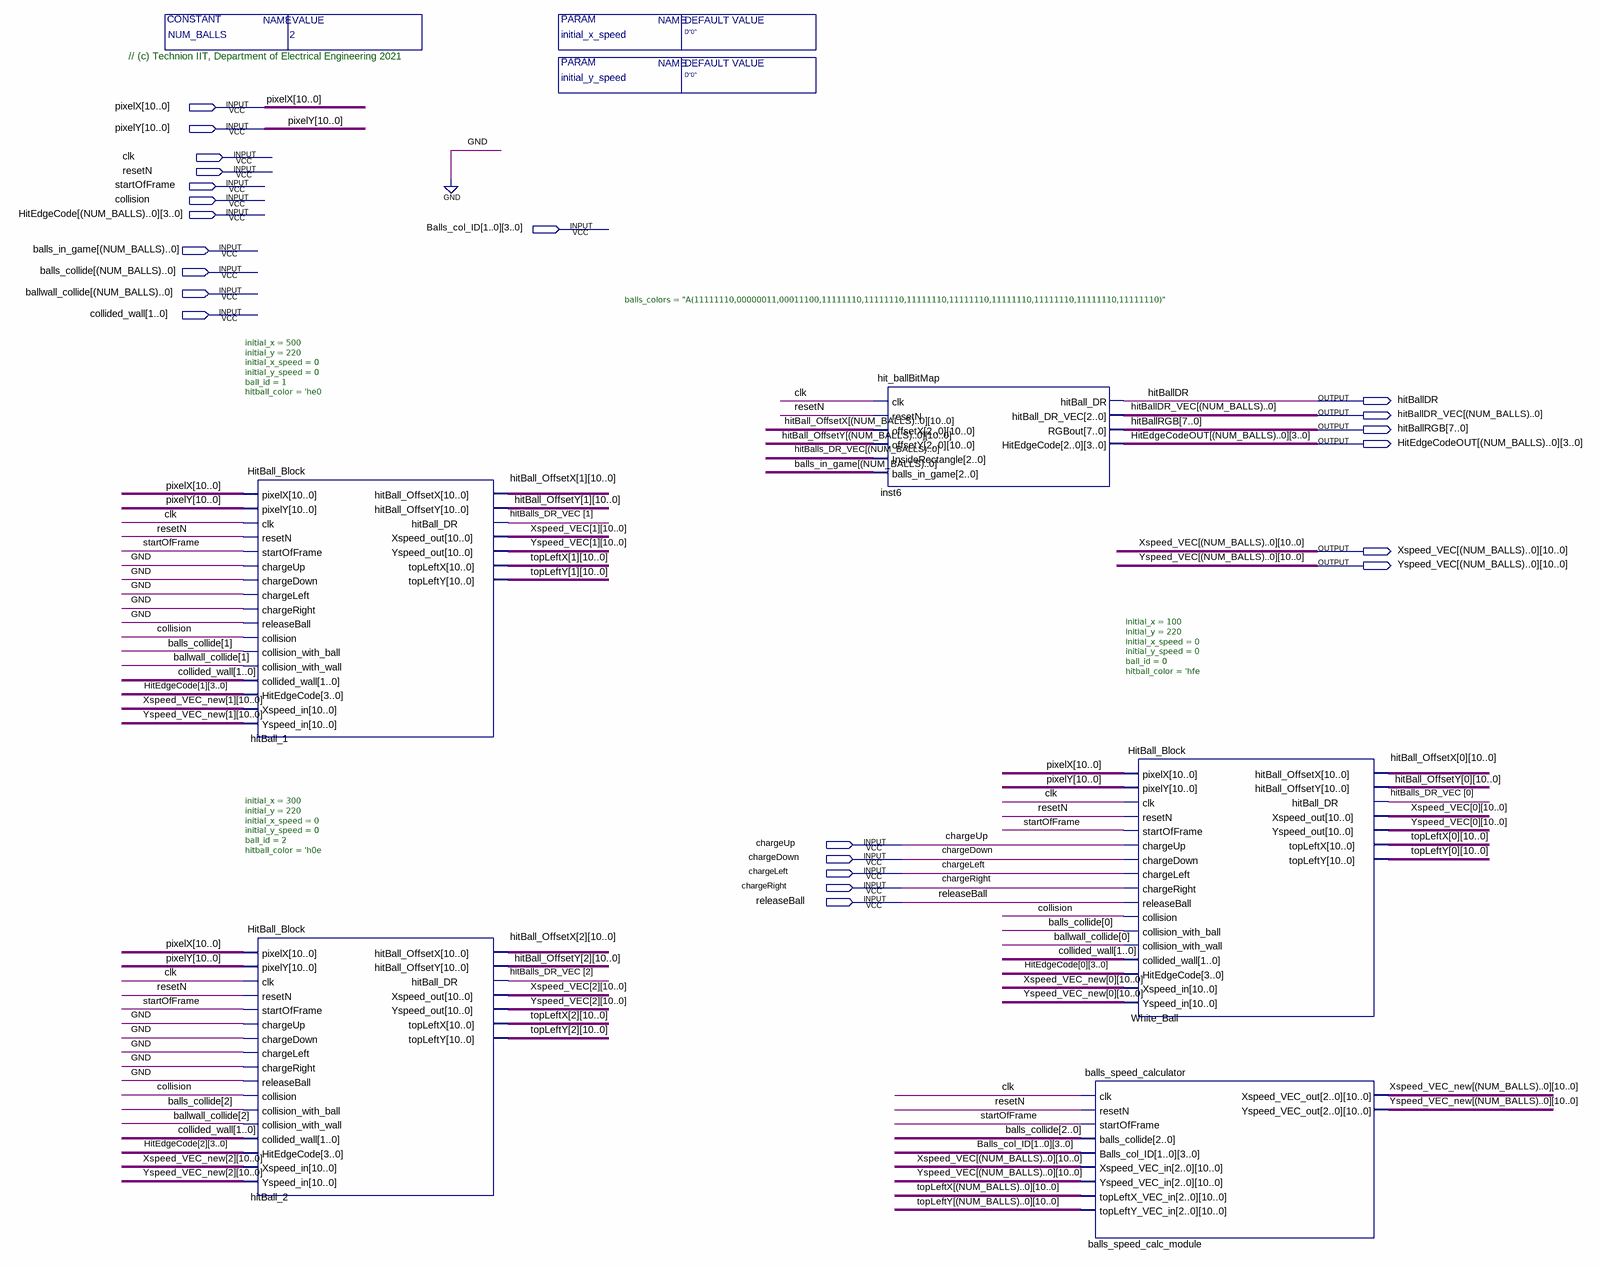
[diagram p0: schematic sheet]
// Quartus schematic United_HitBalls_Block.bdf as structural Verilog: 5 symbols, 23 pins
module United_HitBalls_Block #(parameter initial_x_speed = "D\"0\"", parameter initial_y_speed = "D\"0\"", parameter NUM_BALLS = 2) (
  input  [10:0] pixelX,
  input  [10:0] pixelY,
  input  clk,
  input  resetN,
  input  startOfFrame,
  input  collision,
  input  [3:0] HitEdgeCode_2,
  input  [3:0] HitEdgeCode_1,
  input  [3:0] HitEdgeCode_0,
  input  [3:0] Balls_col_ID_1,
  input  [3:0] Balls_col_ID_0,
  input  [2:0] balls_in_game,
  input  [2:0] balls_collide,
  input  [2:0] ballwall_collide,
  input  [1:0] collided_wall,
  input  chargeUp,
  input  chargeDown,
  input  chargeLeft,
  input  chargeRight,
  input  releaseBall,
  output hitBallDR,
  output [2:0] hitBallDR_VEC,
  output [7:0] hitBallRGB,
  output [3:0] HitEdgeCodeOUT_2,
  output [3:0] HitEdgeCodeOUT_1,
  output [3:0] HitEdgeCodeOUT_0,
  output [10:0] Xspeed_VEC_2,
  output [10:0] Xspeed_VEC_1,
  output [10:0] Xspeed_VEC_0,
  output [10:0] Yspeed_VEC_2,
  output [10:0] Yspeed_VEC_1,
  output [10:0] Yspeed_VEC_0
);

  wire [2:0] hitBalls_DR_VEC;
  wire [10:0] hitBall_OffsetX_0, hitBall_OffsetX_1, hitBall_OffsetX_2, hitBall_OffsetY_0, hitBall_OffsetY_1,
       hitBall_OffsetY_2, topLeftX_0, topLeftX_1, topLeftX_2, topLeftY_0, topLeftY_1, topLeftY_2,
       Xspeed_VEC_new_0, Xspeed_VEC_new_1, Xspeed_VEC_new_2, Yspeed_VEC_new_0, Yspeed_VEC_new_1,
       Yspeed_VEC_new_2;

  HitBall_Block #(.initial_x(500), .initial_y(220), .initial_x_speed(0), .initial_y_speed(0), .ball_id(1), .hitball_color('he0)) hitBall_1 (
    .pixelX(pixelX), .pixelY(pixelY), .clk(clk), .resetN(resetN), .startOfFrame(startOfFrame),
    .chargeUp(1'b0), .chargeDown(1'b0), .chargeLeft(1'b0), .chargeRight(1'b0), .releaseBall(1'b0),
    .collision(collision), .collision_with_ball(balls_collide[1]), .collision_with_wall(ballwall_collide[1]),
    .collided_wall(collided_wall), .HitEdgeCode(HitEdgeCode_1), .Xspeed_in(Xspeed_VEC_new_1),
    .Yspeed_in(Yspeed_VEC_new_1), .hitBall_OffsetX(hitBall_OffsetX_1), .hitBall_OffsetY(hitBall_OffsetY_1),
    .hitBall_DR(hitBalls_DR_VEC[1]), .Xspeed_out(Xspeed_VEC_1), .Yspeed_out(Yspeed_VEC_1),
    .topLeftX(topLeftX_1), .topLeftY(topLeftY_1));
  HitBall_Block #(.initial_x(300), .initial_y(220), .initial_x_speed(0), .initial_y_speed(0), .ball_id(2), .hitball_color('h0e)) hitBall_2 (
    .pixelX(pixelX), .pixelY(pixelY), .clk(clk), .resetN(resetN), .startOfFrame(startOfFrame),
    .chargeUp(1'b0), .chargeDown(1'b0), .chargeLeft(1'b0), .chargeRight(1'b0), .releaseBall(1'b0),
    .collision(collision), .collision_with_ball(balls_collide[2]), .collision_with_wall(ballwall_collide[2]),
    .collided_wall(collided_wall), .HitEdgeCode(HitEdgeCode_2), .Xspeed_in(Xspeed_VEC_new_2),
    .Yspeed_in(Yspeed_VEC_new_2), .hitBall_OffsetX(hitBall_OffsetX_2), .hitBall_OffsetY(hitBall_OffsetY_2),
    .hitBall_DR(hitBalls_DR_VEC[2]), .Xspeed_out(Xspeed_VEC_2), .Yspeed_out(Yspeed_VEC_2),
    .topLeftX(topLeftX_2), .topLeftY(topLeftY_2));
  hit_ballBitMap #(.balls_colors("A(11111110,00000011,00011100,11111110,11111110,11111110,11111110,11111110,11111110,11111110,11111110)")) inst6 (
    .clk(clk), .resetN(resetN), .offsetX({hitBall_OffsetX_2, hitBall_OffsetX_1, hitBall_OffsetX_0}),
    .offsetY({hitBall_OffsetY_2, hitBall_OffsetY_1, hitBall_OffsetY_0}), .InsideRectangle(hitBalls_DR_VEC),
    .balls_in_game(balls_in_game), .hitBall_DR(hitBallDR), .hitBall_DR_VEC(hitBallDR_VEC),
    .RGBout(hitBallRGB), .HitEdgeCode({HitEdgeCodeOUT_2, HitEdgeCodeOUT_1, HitEdgeCodeOUT_0}));
  balls_speed_calculator balls_speed_calc_module (
    .clk(clk), .resetN(resetN), .startOfFrame(startOfFrame), .balls_collide(balls_collide),
    .Balls_col_ID({Balls_col_ID_1, Balls_col_ID_0}),
    .Xspeed_VEC_in({Xspeed_VEC_2, Xspeed_VEC_1, Xspeed_VEC_0}),
    .Yspeed_VEC_in({Yspeed_VEC_2, Yspeed_VEC_1, Yspeed_VEC_0}),
    .topLeftX_VEC_in({topLeftX_2, topLeftX_1, topLeftX_0}),
    .topLeftY_VEC_in({topLeftY_2, topLeftY_1, topLeftY_0}),
    .Xspeed_VEC_out({Xspeed_VEC_new_2, Xspeed_VEC_new_1, Xspeed_VEC_new_0}),
    .Yspeed_VEC_out({Yspeed_VEC_new_2, Yspeed_VEC_new_1, Yspeed_VEC_new_0}));
  HitBall_Block #(.initial_x(100), .initial_y(220), .initial_x_speed(0), .initial_y_speed(0), .ball_id(0), .hitball_color('hfe)) White_Ball (
    .pixelX(pixelX), .pixelY(pixelY), .clk(clk), .resetN(resetN), .startOfFrame(startOfFrame),
    .chargeUp(chargeUp), .chargeDown(chargeDown), .chargeLeft(chargeLeft), .chargeRight(chargeRight),
    .releaseBall(releaseBall), .collision(collision), .collision_with_ball(balls_collide[0]),
    .collision_with_wall(ballwall_collide[0]), .collided_wall(collided_wall), .HitEdgeCode(HitEdgeCode_0),
    .Xspeed_in(Xspeed_VEC_new_0), .Yspeed_in(Yspeed_VEC_new_0), .hitBall_OffsetX(hitBall_OffsetX_0),
    .hitBall_OffsetY(hitBall_OffsetY_0), .hitBall_DR(hitBalls_DR_VEC[0]), .Xspeed_out(Xspeed_VEC_0),
    .Yspeed_out(Yspeed_VEC_0), .topLeftX(topLeftX_0), .topLeftY(topLeftY_0));

  // Notes on the sheet:
  //   // (c) Technion IIT, Department of Electrical Engineering 2021
endmodule
